# EAGLE design logger2 (EAGLE 9.6.0)
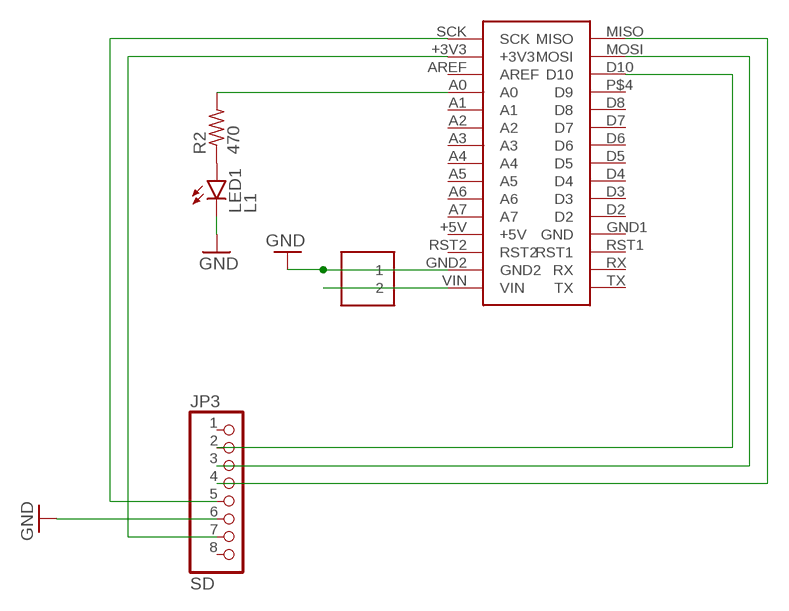
[diagram p0: schematic, sheet 1]

## Parts
J1  1X2-3.5MM  [1X2-3.5MM]
JP3  SD  PINHD-1X8BIG  [1X08-BIG]
LED1  L1  LEDSFH482  [SFH482]
MC1  NANODEVICE  [NANO]
R2  470  R-US_V526-0  [V526-0]

## Nets
GND: J1.1 JP3.6 LED1.K(C) MC1.GND2
N$1: JP3.5 MC1.SCK
N$2: JP3.7 MC1.+3V3
N$3: J1.2 MC1.VIN
N$4: JP3.3 MC1.MOSI
N$5: JP3.4 MC1.MISO
N$6: LED1.A R2.1
N$7: JP3.2 MC1.D10
N$8: MC1.A0 R2.2
Unconnected: JP3.1 JP3.8 MC1.+5V MC1.A1 MC1.A2 MC1.A3 MC1.A4 MC1.A5 MC1.A6 MC1.A7 MC1.AREF MC1.D2 MC1.D3 MC1.D4 MC1.D5 MC1.D6 MC1.D7 MC1.D8 MC1.GND1(GND) MC1.P$4(D9) MC1.RST1 MC1.RST2 MC1.RX MC1.TX

## Library data of the parts
J1 = adafruit:1X2: 3.5mm Terminal block http://www.ladyada.net/library/pcb/eaglelibrary.html
JP3 = adafruit:PINHD-1X8: PIN HEADER
LED1 = led:LED: LED OSRAM: - CHIPLED LG R971, LG N971, LY N971, LG Q971, LY Q971, LO R971, LY R971 LH N974, LH R974 LS Q976, LO Q976, LY Q976 LO Q996 - Hyper CHIPLED LW Q18S LB Q993, LB Q99A, LB R99A - SideLED LS A670, LO A670, LY A670, LG A670, LP A670 LB A673, LV A673, LT A673, LW A673 LH A674 LY A675 LS A676, LA A676, LO A676, LY A676, LW A676 LS A679, LY A679, LG A679 - Hyper Micro SIDELED® LS Y876, LA Y876, LO Y876, LY Y876 LT Y87S - SmartLED LW L88C, LW L88S LB L89C, LB L89S, LG L890 LS L89K, LO L89K, LY L89K LS L896, LA L896, LO L896, LY L896 - TOPLED LS T670, LO T670, LY T670, LG T670, LP T670 LSG T670, LSP T670, LSY T670, LOP T670, LYG T670 LG T671, LOG T671, LSG T671 LB T673, LV T673, LT T673, LW T673 LH T674 LS T676, LA T676, LO T676, LY T676, LB T676, LH T676, LSB T676, LW T676 LB T67C, LV T67C, LT T67C, LS T67K, LO T67K, LY T67K, LW E67C LS E67B, LA E67B, LO E67B, LY E67B, LB E67C, LV E67C, LT E67C LW T67C LS T679, LY T679, LG T679 LS T770, LO T770, LY T770, LG T770, LP T770 LB T773, LV T773, LT T773, LW T773 LH T774 LS E675, LA E675, LY E675, LS T675 LS T776, LA T776, LO T776, LY T776, LB T776 LHGB T686 LT T68C, LB T68C - Hyper Mini TOPLED® LB M676 - Mini TOPLED Santana® LG M470 LS M47K, LO M47K, LY M47K Source: http://www.osram.convergy.de LUXEON: - LUMILED® LXK2-PW12-R00, LXK2-PW12-S00, LXK2-PW14-U00, LXK2-PW14-V00 LXK2-PM12-R00, LXK2-PM12-S00, LXK2-PM14-U00 LXK2-PE12-Q00, LXK2-PE12-R00, LXK2-PE12-S00, LXK2-PE14-T00, LXK2-PE14-U00 LXK2-PB12-K00, LXK2-PB12-L00, LXK2-PB12-M00, LXK2-PB14-N00, LXK2-PB14-P00, LXK2-PB14-Q00 LXK2-PR12-L00, LXK2-PR12-M00, LXK2-PR14-Q00, LXK2-PR14-R00 LXK2-PD12-Q00, LXK2-PD12-R00, LXK2-PD12-S00 LXK2-PH12-R00, LXK2-PH12-S00 LXK2-PL12-P00, LXK2-PL12-Q00, LXK2-PL12-R00 Source: www.luxeon.com KINGBRIGHT: KA-3528ASYC Source: www.kingbright.com
MC1 = mylibrary:NANODEVICE: Arduino NANO 33 BLE Sense
R2 = adafruit:R-US_: RESISTOR, American symbol

## Board
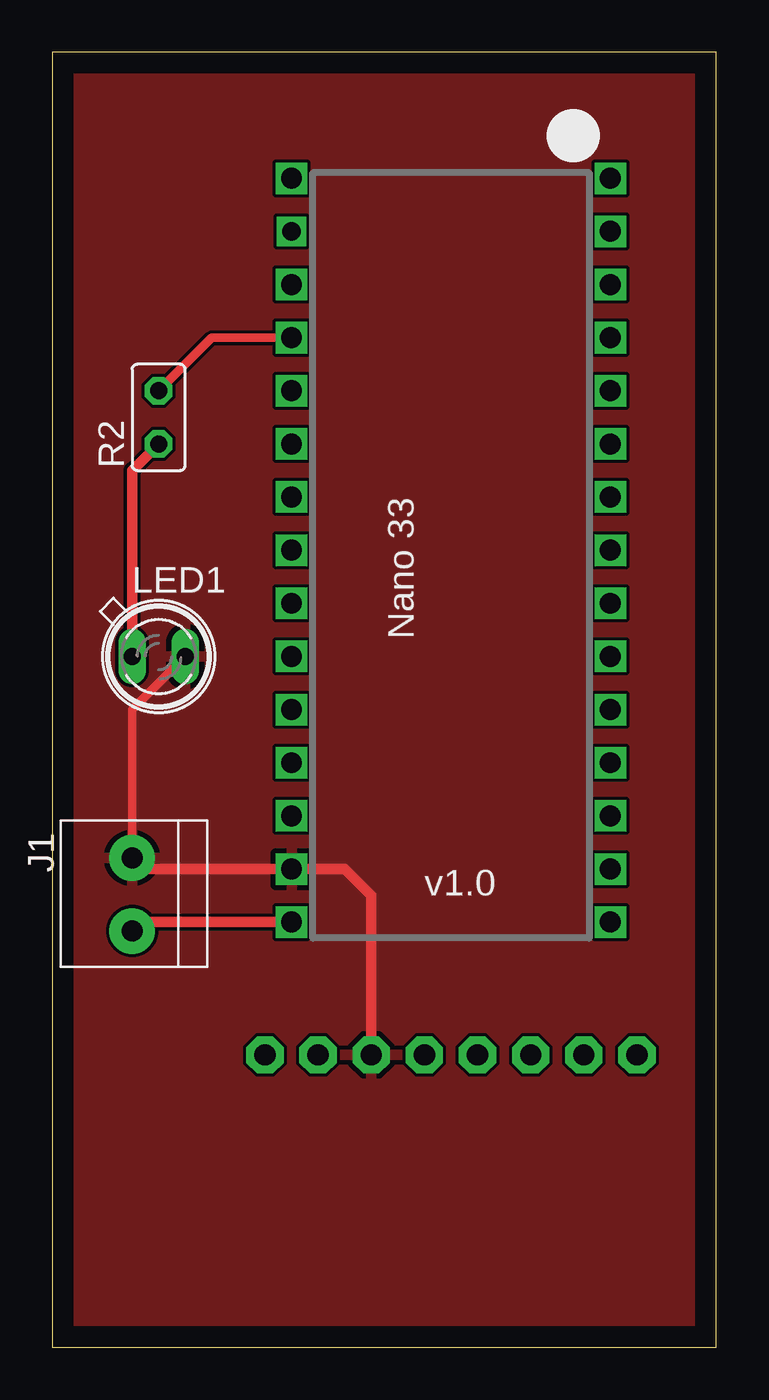
[diagram p1: board, top side]
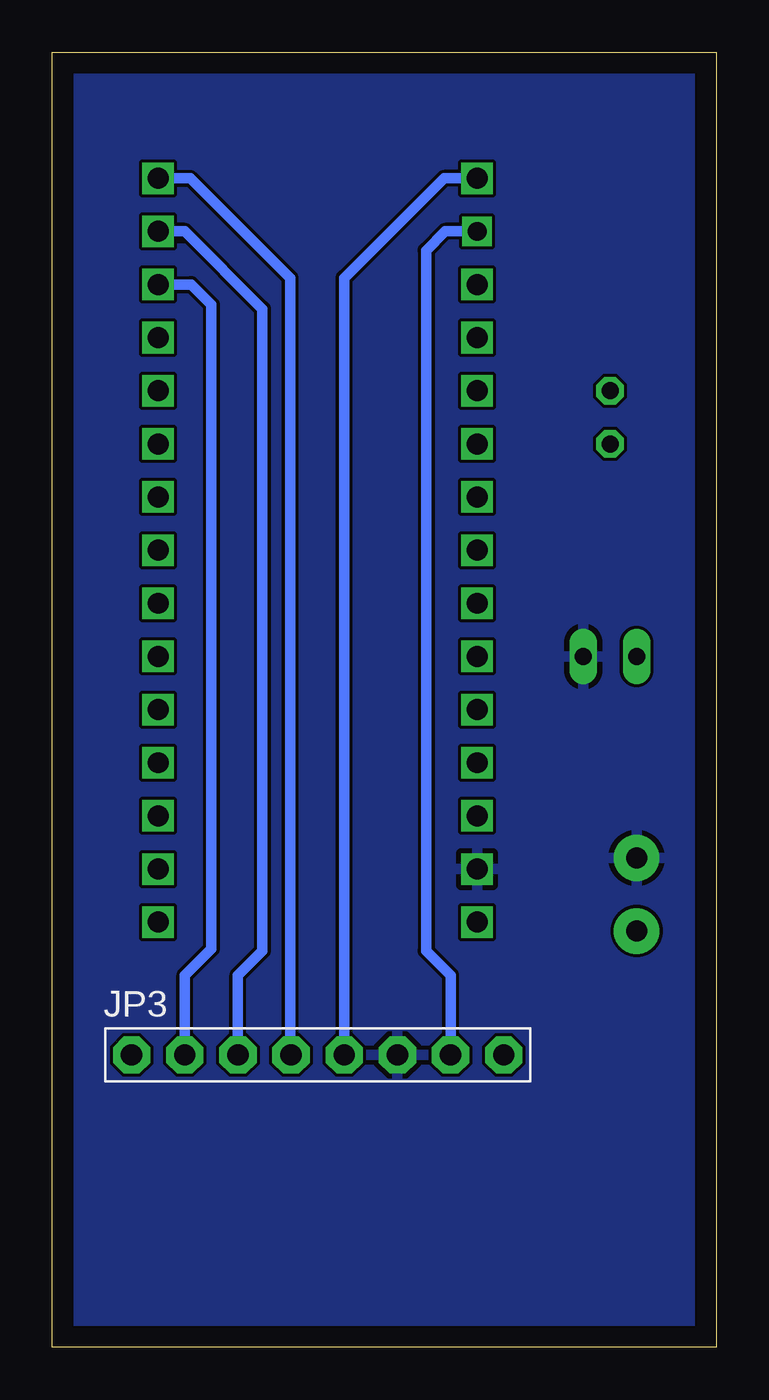
[diagram p2: board, bottom side, seen from below]

Size 31.73 x 61.9 mm. Coordinates in mm from the lower left corner, seen from the top.
Outline: 0,0 31.73,0 31.73,61.9 0,61.9 0,0
Copper layers (1*16): Top 0.035mm / dielectric 1.5mm / Bottom 0.035mm
Design rules "default": minimum track width 6mil, minimum drill 0.35mm, track to track 6mil, track to pad 6mil, pad to pad 6mil, via to via 6mil, smd to smd 6mil, copper to edge 40mil, drill to drill 6mil, minimum pad ring 10mil, minimum via ring 8mil, stop-mask expansion 4mil, vias tented up to drill 0mil, thermal gap 10mil

### Footprints (pad centres in the part's own frame; a part is rotated, then mirrored left to right if it is on the bottom)
1X2-3.5MM = drill 1 pad 2.184: 1 1.8,0; 2 -1.7,0
1X08-BIG = drill 1.016 pad 1.778 octagon: 1 -8.89,0; 2 -6.35,0; 3 -3.81,0; 4 -1.27,0; 5 1.27,0; 6 3.81,0; 7 6.35,0; 8 8.89,0
SFH482 = drill 0.813 long: A -1.27,0; K 1.27,0
NANO = drill 0.9 square: +3V3 -7.62,16.51 | drill 1 square: +5V -7.62,-8.89; A0 -7.62,11.43; A1 -7.62,8.89; A2 -7.62,6.35; A3 -7.62,3.81; A4 -7.62,1.27; A5 -7.62,-1.27; A6 -7.62,-3.81; A7 -7.62,-6.35; AREF -7.62,13.97; D2 7.62,-6.35; D3 7.62,-3.81; D4 7.62,-1.27; D5 7.62,1.27; D6 7.62,3.81; D7 7.62,6.35; D8 7.62,8.89; D10 7.62,13.97; GND1 7.62,-8.89; GND2 -7.62,-13.97; MISO 7.62,19.05; MOSI 7.62,16.51; P$4 7.62,11.43; RST1 7.62,-11.43; RST2 -7.62,-11.43; RX 7.62,-13.97; SCK -7.62,19.05; TX 7.62,-16.51; VIN -7.62,-16.51
V526-0 = drill 0.813 octagon: 1 -1.27,0; 2 1.27,0

### Placement (x,y rotation side)
J1  3.81,21.59 90 top
JP3  19.05,13.97 0 bottom
LED1  5.08,33.02 0 top
MC1  19.05,36.83 0 top
R2  5.08,44.45 90 top

### Tracks (layer width: path | path; a pad name or v marks a point on that pad's centre or on a via)
GND
  Top 0.406: LED1.K 3.81,30.48 J1.1
  Top 0.508: JP3.6 15.24,21.59 13.97,22.86 MC1.GND2 4.34,22.86 J1.1
  pour Top (isolate 0): 0,62.23 31.75,62.23 31.75,0 0,0
  pour Bottom (isolate 0): 0,62.23 31.75,62.23 31.75,0 0,0
N$1
  Bottom 0.508: MC1.SCK 13,55.88 17.78,51.11 JP3.5
N$2
  Bottom 0.508: MC1.+3V3 12.95,53.34 13.87,52.43 13.87,18.95 12.7,17.78 JP3.7
N$3
  Top 0.508: J1.2 4.24,20.32 MC1.VIN
N$4
  Bottom 0.508: MC1.MOSI 25.4,53.34 21.69,49.63 21.69,18.95 22.86,17.78 JP3.3
N$5
  Bottom 0.152: 20.37,14.07 JP3.4
  Bottom 0.508: MC1.MISO 25.15,55.88 20.37,51.11 20.37,14.07
N$6
  Top 0.508: LED1.A 3.81,41.91 R2.1
N$7
  Bottom 0.508: MC1.D10 25.09,50.8 24.13,49.83 24.13,19.05 25.4,17.78 JP3.2
N$8
  Top 0.406: R2.2 7.62,48.26 MC1.A0